# Altium schematic sheet STM32.SchDoc
size 533 x 330 mm; SheetNumber: 1; SheetTotal: 1
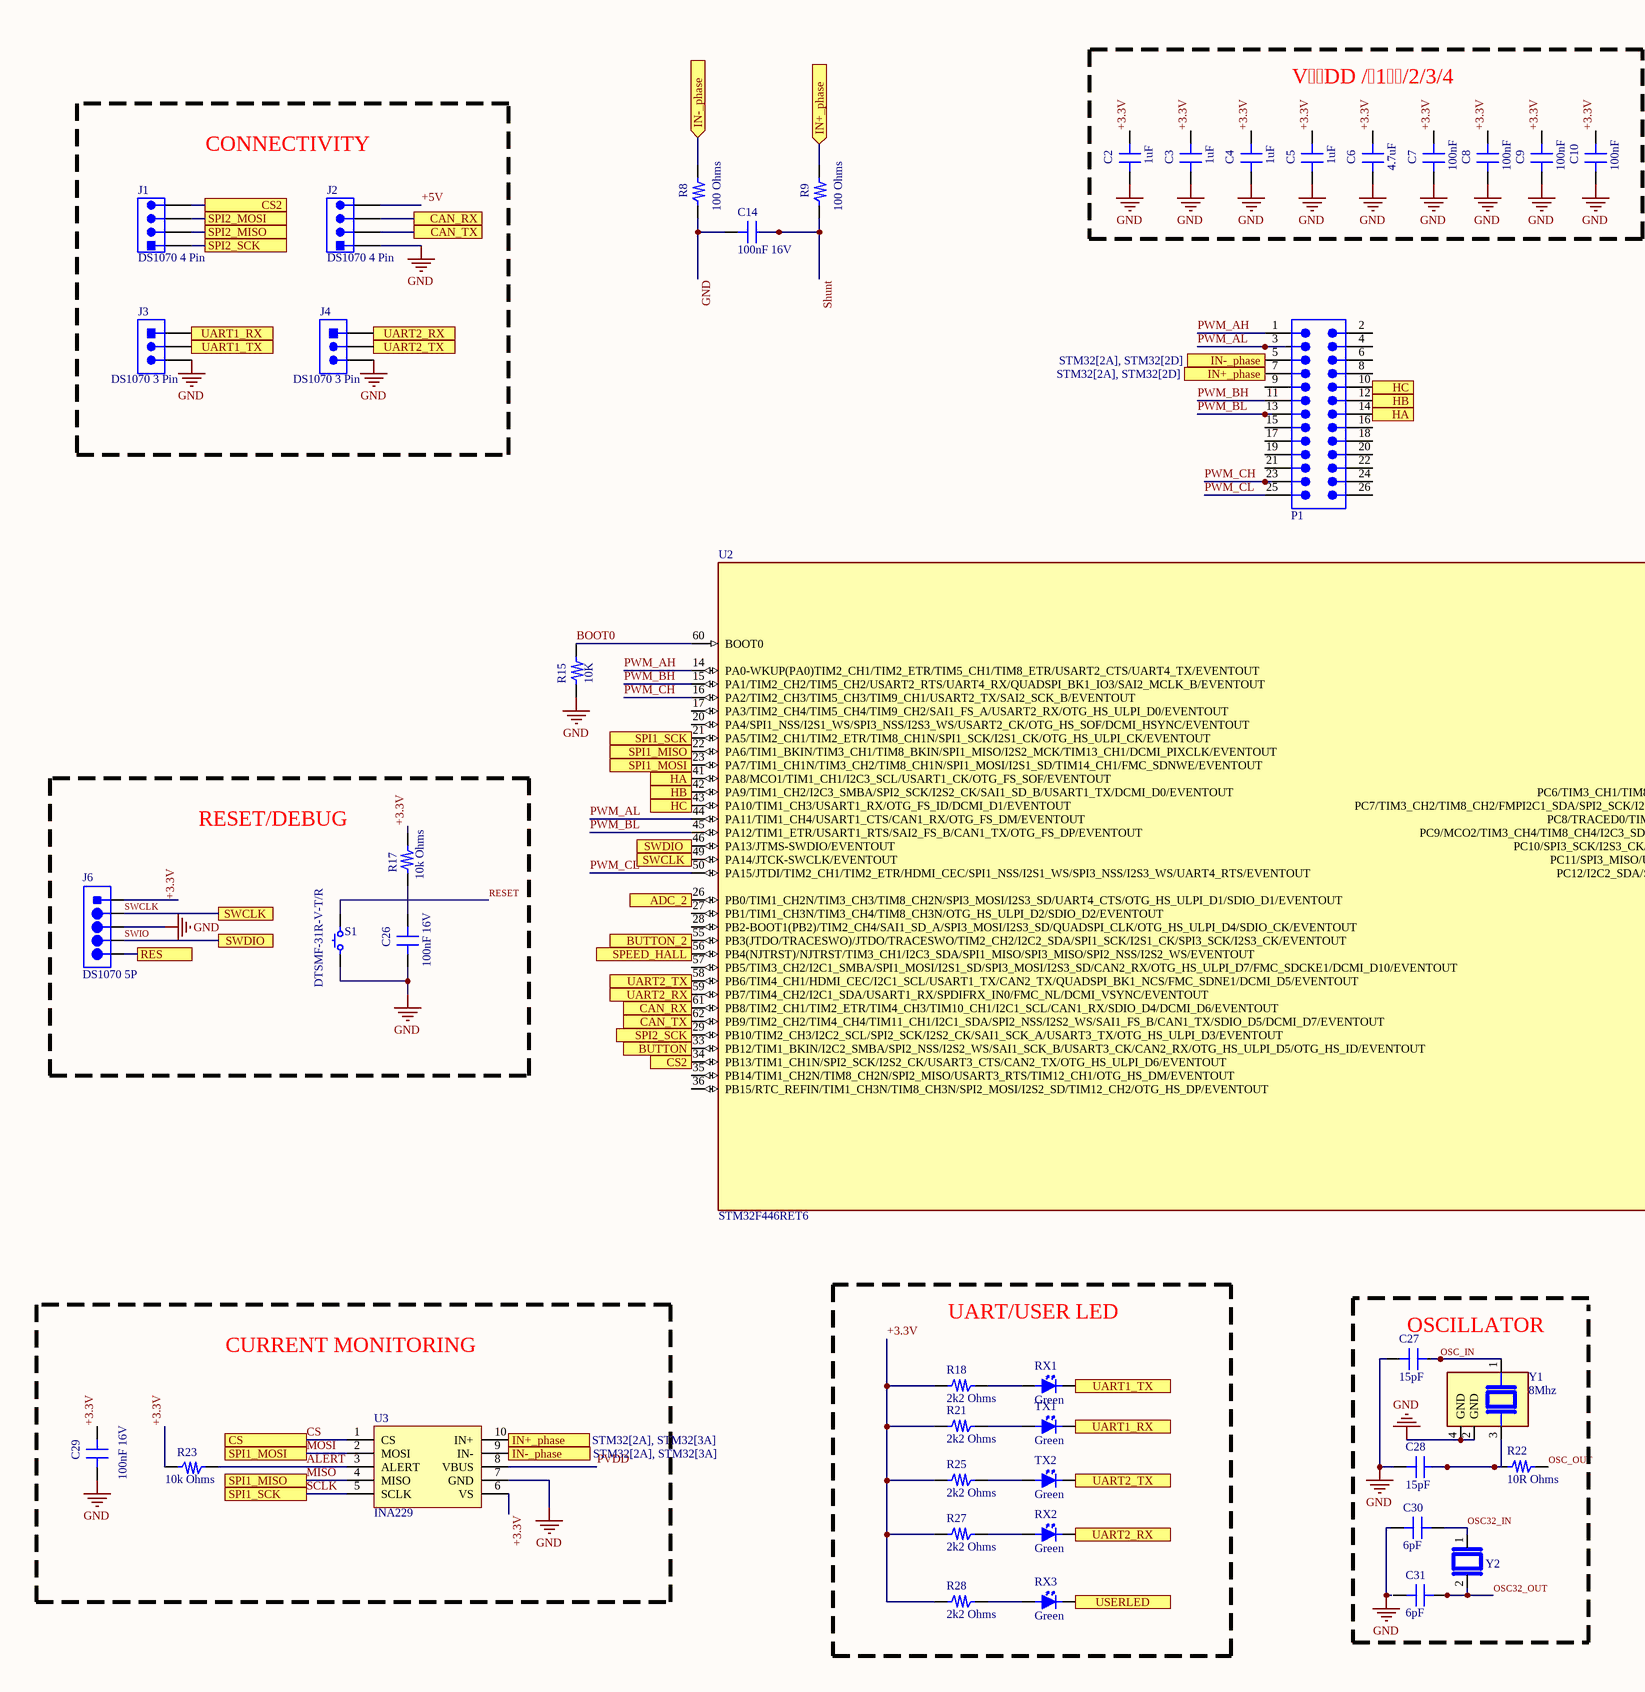
[diagram p0: STM32.SchDoc, left]
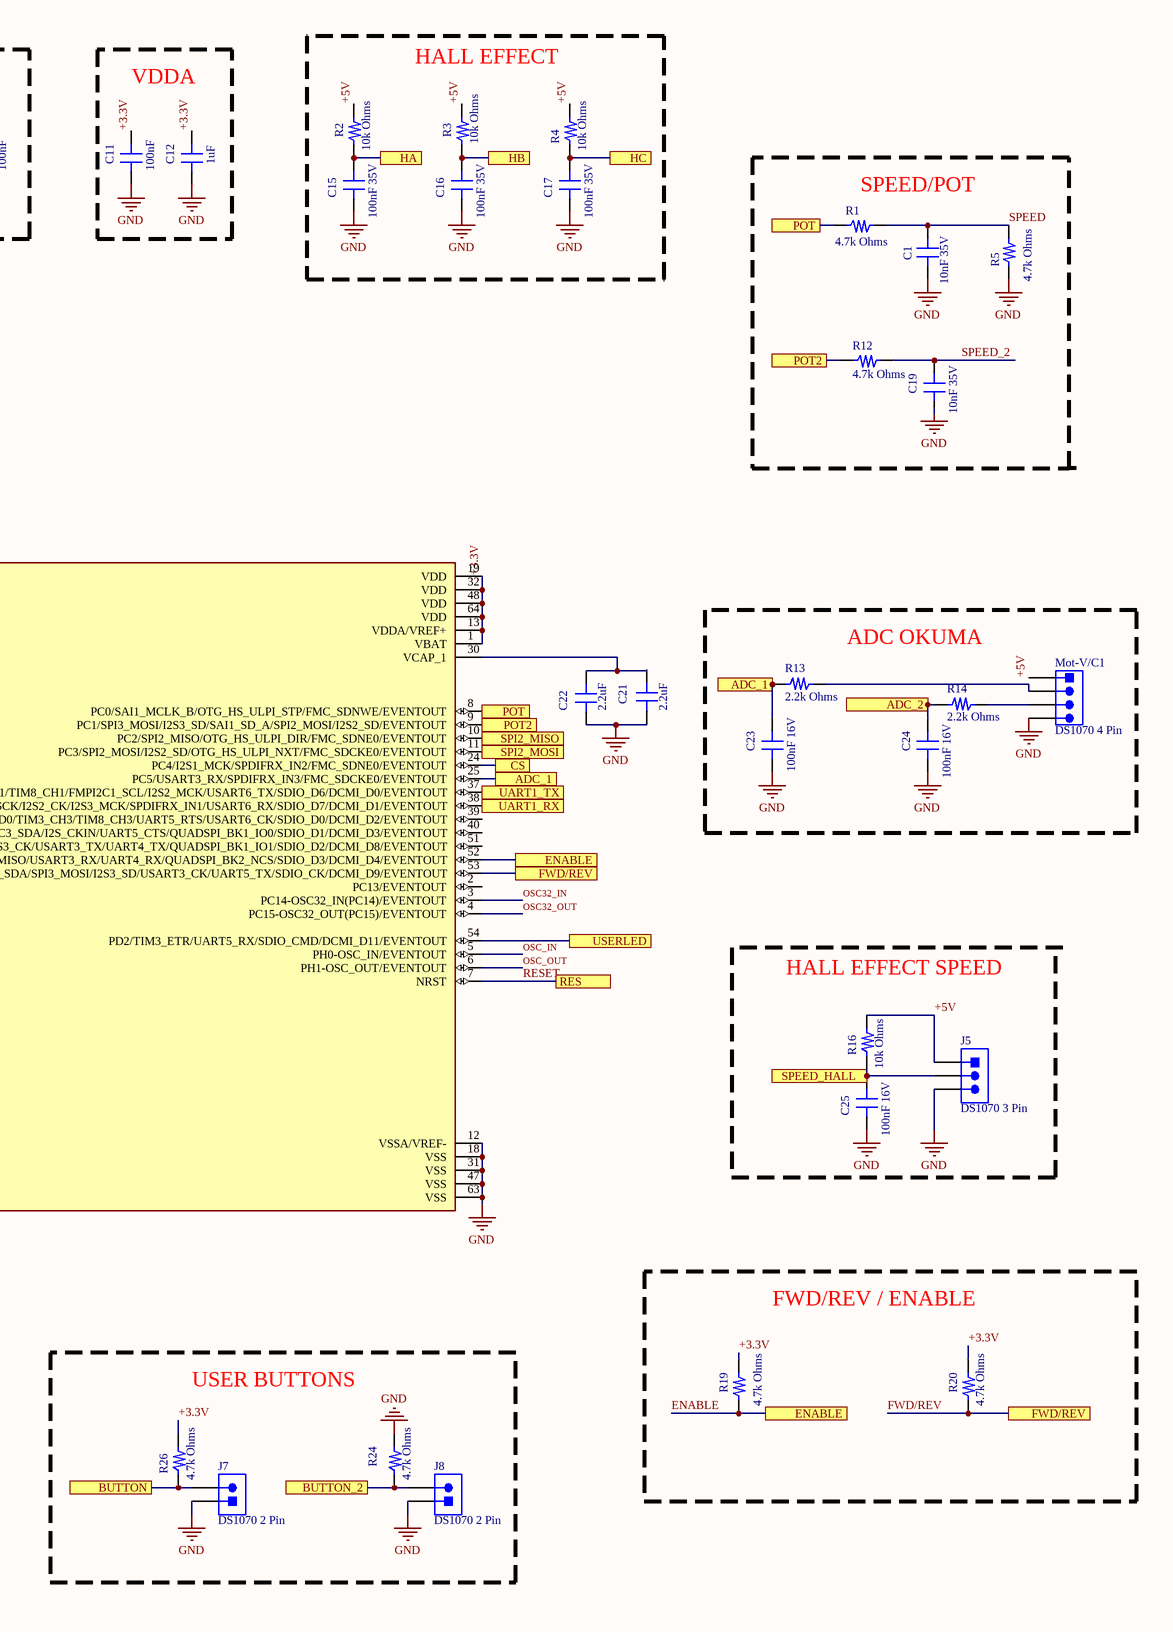
[diagram p1: STM32.SchDoc, right]

## Parts
C1  10nF 35V  [0805_CAP]
C2  1uF  [0603_CAP]
C3  1uF  [0603_CAP]
C4  1uF  [0603_CAP]
C5  1uF  [0603_CAP]
C6  4.7uF  [0603_CAP]
C7  100nF  [0603_CAP]
C8  100nF  [0603_CAP]
C9  100nF  [0603_CAP]
C10  100nF  [0603_CAP]
C11  100nF  [0603_CAP]
C12  1uF  [0603_CAP]
C14  100nF 16V  [0603_CAP]
C15  100nF 35V  [0805_CAP]
C16  100nF 35V  [0805_CAP]
C17  100nF 35V  [0805_CAP]
C19  10nF 35V  [0805_CAP]
C21  2.2uF  [0603_CAP]
C22  2.2uF  [0603_CAP]
C23  100nF 16V  [0805_CAP]
C24  100nF 16V  [0805_CAP]
C25  100nF 16V  [0805_CAP]
C26  100nF 16V  [0805_CAP]
C27  15pF  [0603_CAP]
C28  15pF  [0603_CAP]
C29  100nF 16V  [0603_CAP]
C30  6pF  [0603_CAP]
C31  6pF  [0603_CAP]
J1  DS1070 4 Pin  [4PIN_100MIL]
J2  DS1070 4 Pin  [4PIN_100MIL]
J3  DS1070 3 Pin  [3pin_100mil]
J4  DS1070 3 Pin  [3pin_100mil]
J5  DS1070 3 Pin  [3pin_100mil]
J6  DS1070 5P  [5PIN]
J7  DS1070 2 Pin  [2PIN_100mil]
J8  DS1070 2 Pin  [2PIN_100mil]
Mot-V/C1  DS1070 4 Pin  [4PIN_100MIL]
P1  61302621121  [61302621121]  (value not drawn)
R1  4.7k Ohms  [0805_RES]
R2  10k Ohms  [0805_RES]
R3  10k Ohms  [0805_RES]
R4  10k Ohms  [0805_RES]
R5  4.7k Ohms  [0805_RES]
R8  100 Ohms  [0603_RES]
R9  100 Ohms  [0603_RES]
R12  4.7k Ohms  [0805_RES]
R13  2.2k Ohms  [0805_RES]
R14  2.2k Ohms  [0805_RES]
R15  10K  [0603_RES]
R16  10k Ohms  [0805_RES]
R17  10k Ohms  [0805_RES]
R18  2k2 Ohms  [0805_RES]
R19  4.7k Ohms  [0805_RES]
R20  4.7k Ohms  [0805_RES]
R21  2k2 Ohms  [0805_RES]
R22  10R Ohms  [0603_RES]
R23  10k Ohms  [0603_RES]
R24  4.7k Ohms  [0805_RES]
R25  2k2 Ohms  [0805_RES]
R26  4.7k Ohms  [0805_RES]
R27  2k2 Ohms  [0805_RES]
R28  2k2 Ohms  [0805_RES]
RX1  Green  [0805LED]
RX2  Green  [0805LED]
RX3  Green  [0805LED]
S1  DTSMF-31R-V-T/R  [Button]
TX1  Green  [0805LED]
TX2  Green  [0805LED]
U2  STM32F446RET6  [QFP50P1200X1200X160-64N]
U3  INA229  [INA229]
Y1  8Mhz  [XTAL_ABM8-25.000MHZ-B2-T]
Y2  CC7V-T1A-32.768KHZ-9PF-20PPM-TA-QC  [XTAL_CC7V-T1A-32.768KHZ-9PF-20PPM-TA-QC]  (value not drawn)

## Blocks framed on the sheet
HALL EFFECT: C15-C17 R2-R4
VDD /1/2/3/4: C2-C10
VDDA: C11 C12
CONNECTIVITY: J1-J4
ADC OKUMA: C23 C24 Mot-V/C1 R13 R14
RESET/DEBUG: C26 J6 R17 S1
FWD/REV / ENABLE: R19 R20
CURRENT MONITORING: C29 R23 U3
UART/USER LED: R18 R21 R25 R27 R28 RX1-RX3 TX1 TX2
USER BUTTONS: J7 J8 R24 R26

## Ports
ADC_1 (see STM32[5B]), ADC_2 (see STM32[2C]), ADC_2 (see STM32[6B]), BUTTON (see STM32[2C]), BUTTON (see STM32[4D]), BUTTON_2 (see STM32[2C]), BUTTON_2 (see STM32[5D]), CAN_RX (see STM32[1A]), CAN_TX (see STM32[1A]), CS2 (see STM32[1B]), CS2 (see STM32[2C]), CS (see STM32[1D]), CS (see STM32[5B]), ENABLE (see STM32[5C]), ENABLE (see STM32[6D]), FWD/REV (see STM32[5C]), FWD/REV (see STM32[6D]), HA (see STM32[2B], STM32[3A]), HA (see STM32[2B], STM32[5A]), HA (see STM32[3A], STM32[5A]), HB (see STM32[2B], STM32[3A]), HB (see STM32[2B], STM32[5A]), HB (see STM32[3A], STM32[5A]), HC (see STM32[2B], STM32[3A]), HC (see STM32[2B], STM32[5A]), HC (see STM32[3A], STM32[5A]), IN+_phase (in, see STM32[2A], STM32[2D]), IN+_phase (in, see STM32[2A], STM32[3A]), IN+_phase (in, see STM32[2D], STM32[3A]), IN-_phase (in, see STM32[2A], STM32[2D]), IN-_phase (in, see STM32[2A], STM32[3A]), IN-_phase (in, see STM32[2D], STM32[3A]), POT2 (see STM32[5B]), POT2 (see STM32[6A]), POT (see STM32[5B]), POT (see STM32[6A]), RES (see STM32[1C]), RES (see STM32[5C]), SPEED_HALL (see STM32[2C]), SPEED_HALL (see STM32[6C]), SPI1_MISO (see STM32[1D]), SPI1_MISO (see STM32[2B]), SPI1_MOSI (see STM32[1D]), SPI1_MOSI (see STM32[2B]), SPI1_SCK (see STM32[1D]), SPI1_SCK (see STM32[2B]), SPI2_MISO (see STM32[1B]), SPI2_MISO (see STM32[5B]), SPI2_MOSI (see STM32[1B]), SPI2_MOSI (see STM32[5B]), SPI2_SCK (see STM32[1B]), SPI2_SCK (see STM32[2C]), SWCLK (see STM32[1C]), SWCLK (see STM32[2C]), SWDIO (see STM32[1C]), SWDIO (see STM32[2B]), UART1_RX (see STM32[1B], STM32[3D]), UART1_RX (see STM32[1B], STM32[5B]), UART1_RX (see STM32[3D], STM32[5B]), UART1_TX (see STM32[1B], STM32[3D]), UART1_TX (see STM32[1B], STM32[5B]), UART1_TX (see STM32[3D], STM32[5B]), UART2_RX (see STM32[1B], STM32[2C]), UART2_RX (see STM32[1B], STM32[3D]), UART2_RX (see STM32[2C], STM32[3D]), UART2_TX (see STM32[1B], STM32[2C]), UART2_TX (see STM32[1B], STM32[3D]), UART2_TX (see STM32[2C], STM32[3D]), USERLED (see STM32[3D]), USERLED (see STM32[5C])

## Nets
GND: C1.1 C2.2 C3.2 C4.2 C5.2 C6.2 C7.2 C8.2 C9.2 C10.2 C11.2 C12.2 C14.2 C15.1 C16.1 C17.1 C19.1 C21.2 C22.2 C23.1 C24.1 C25.1 C26.1 C27.1 C28.1 C29.1 C30.1 J2.1 J3.3 J4.3 J5.3 J6.3 J7.1 J8.1 Mot-V/C1.4 R5.2 R8.2 R15.2 R24.1 S1.1 U2.12(VSSA/VREF-) U2.18(VSS) U2.31(VSS) U2.47(VSS) U2.63(VSS) U3.7(GND) Y1.2(GND) Y1.4(GND)
+3.3V: C2.1 C3.1 C4.1 C5.1 C6.1 C7.1 C8.1 C9.1 C10.1 C11.1 C12.1 C29.2 J6.1 R17.2 R18.1 R19.1 R20.1 R21.1 R23.2 R25.1 R26.1 R27.1 R28.1 U2.1(VBAT) U2.13(VDDA/VREF+) U2.19(VDD) U2.32(VDD) U2.48(VDD) U2.64(VDD) U3.6(VS)
+5V: J2.4 J5.1 Mot-V/C1.1 R2.1 R3.1 R4.1 R16.1
ADC_1: C23.2 R13.1 U2.25(PC5/USART3_RX/SPDIFRX_IN3/FMC_SDCKE0/EVENTOUT) ; port ADC_1
ADC_2: C24.2 R14.1 U2.26(PB0/TIM1_CH2N/TIM3_CH3/TIM8_CH2N/SPI3_MOSI/I2S3_SD/UART4_CTS/OTG_HS_ULPI_D1/SDIO_D1/EVENTOUT) ; port ADC_2
ALERT: R23.1 U3.3(ALERT)
BOOT0: R15.1 U2.60(BOOT0)
BUTTON: J7.2 R26.2 U2.33(PB12/TIM1_BKIN/I2C2_SMBA/SPI2_NSS/I2S2_WS/SAI1_SCK_B/USART3_CK/CAN2_RX/OTG_HS_ULPI_D5/OTG_HS_ID/EVENTOUT) ; port BUTTON
BUTTON_2: J8.2 R24.2 U2.55(PB3(JTDO/TRACESWO)/JTDO/TRACESWO/TIM2_CH2/I2C2_SDA/SPI1_SCK/I2S1_CK/SPI3_SCK/I2S3_CK/EVENTOUT) ; port BUTTON_2
CAN_RX: J2.3 U2.61(PB8/TIM2_CH1/TIM2_ETR/TIM4_CH3/TIM10_CH1/I2C1_SCL/CAN1_RX/SDIO_D4/DCMI_D6/EVENTOUT) ; port CAN_RX
CAN_TX: J2.2 U2.62(PB9/TIM2_CH2/TIM4_CH4/TIM11_CH1/I2C1_SDA/SPI2_NSS/I2S2_WS/SAI1_FS_B/CAN1_TX/SDIO_D5/DCMI_D7/EVENTOUT) ; port CAN_TX
CS: U2.24(PC4/I2S1_MCK/SPDIFRX_IN2/FMC_SDNE0/EVENTOUT) U3.1(CS) ; port CS
CS2: J1.4 U2.34(PB13/TIM1_CH1N/SPI2_SCK/I2S2_CK/USART3_CTS/CAN2_TX/OTG_HS_ULPI_D6/EVENTOUT) ; port CS2
ENABLE: R19.2 U2.52(PC11/SPI3_MISO/USART3_RX/UART4_RX/QUADSPI_BK2_NCS/SDIO_D3/DCMI_D4/EVENTOUT) ; port ENABLE
FWD/REV: R20.2 U2.53(PC12/I2C2_SDA/SPI3_MOSI/I2S3_SD/USART3_CK/UART5_TX/SDIO_CK/DCMI_D9/EVENTOUT) ; port FWD/REV
HA: C15.2 P1.14 R2.2 U2.41(PA8/MCO1/TIM1_CH1/I2C3_SCL/USART1_CK/OTG_FS_SOF/EVENTOUT) ; port HA
HB: C16.2 P1.12 R3.2 U2.42(PA9/TIM1_CH2/I2C3_SMBA/SPI2_SCK/I2S2_CK/SAI1_SD_B/USART1_TX/DCMI_D0/EVENTOUT) ; port HB
HC: C17.2 P1.10 R4.2 U2.43(PA10/TIM1_CH3/USART1_RX/OTG_FS_ID/DCMI_D1/EVENTOUT) ; port HC
IN+_phase: P1.7 R9.1 U3.10(IN+) ; port IN+_phase
IN-_phase: P1.5 R8.1 U3.9(IN-) ; port IN-_phase
MISO: U2.22(PA6/TIM1_BKIN/TIM3_CH1/TIM8_BKIN/SPI1_MISO/I2S2_MCK/TIM13_CH1/DCMI_PIXCLK/EVENTOUT) U3.4(MISO) ; port SPI1_MISO
MOSI: U2.23(PA7/TIM1_CH1N/TIM3_CH2/TIM8_CH1N/SPI1_MOSI/I2S1_SD/TIM14_CH1/FMC_SDNWE/EVENTOUT) U3.2(MOSI) ; port SPI1_MOSI
OSC32_IN: C30.2 U2.3(PC14-OSC32_IN(PC14)/EVENTOUT) Y2.1
OSC32_OUT: C31.2 U2.4(PC15-OSC32_OUT(PC15)/EVENTOUT) Y2.2
OSC_IN: C27.2 U2.5(PH0-OSC_IN/EVENTOUT) Y1.1
OSC_OUT: R22.2 U2.6(PH1-OSC_OUT/EVENTOUT)
POT: R1.2 U2.8(PC0/SAI1_MCLK_B/OTG_HS_ULPI_STP/FMC_SDNWE/EVENTOUT) ; port POT
POT2: R12.2 U2.9(PC1/SPI3_MOSI/I2S3_SD/SAI1_SD_A/SPI2_MOSI/I2S2_SD/EVENTOUT) ; port POT2
PVDD: U3.8(VBUS)
PWM_AH: P1.1 U2.14(PA0-WKUP(PA0)TIM2_CH1/TIM2_ETR/TIM5_CH1/TIM8_ETR/USART2_CTS/UART4_TX/EVENTOUT)
PWM_AL: P1.3 U2.44(PA11/TIM1_CH4/USART1_CTS/CAN1_RX/OTG_FS_DM/EVENTOUT)
PWM_BH: P1.11 U2.15(PA1/TIM2_CH2/TIM5_CH2/USART2_RTS/UART4_RX/QUADSPI_BK1_IO3/SAI2_MCLK_B/EVENTOUT)
PWM_BL: P1.13 U2.45(PA12/TIM1_ETR/USART1_RTS/SAI2_FS_B/CAN1_TX/OTG_FS_DP/EVENTOUT)
PWM_CH: P1.23 U2.16(PA2/TIM2_CH3/TIM5_CH3/TIM9_CH1/USART2_TX/SAI2_SCK_B/EVENTOUT)
PWM_CL: P1.25 U2.50(PA15/JTDI/TIM2_CH1/TIM2_ETR/HDMI_CEC/SPI1_NSS/I2S1_WS/SPI3_NSS/I2S3_WS/UART4_RTS/EVENTOUT)
RESET: J6.5 S1.2 U2.7(NRST) ; port RES
SCLK: U2.21(PA5/TIM2_CH1/TIM2_ETR/TIM8_CH1N/SPI1_SCK/I2S1_CK/OTG_HS_ULPI_CK/EVENTOUT) U3.5(SCLK) ; port SPI1_SCK
Shunt: C14.1 R9.2
SPEED: C1.2 R1.1 R5.1
SPEED_2: C19.2 R12.1
SPEED_HALL: C25.2 J5.2 R16.2 U2.56(PB4(NJTRST)/NJTRST/TIM3_CH1/I2C3_SDA/SPI1_MISO/SPI3_MISO/SPI2_NSS/I2S2_WS/EVENTOUT) ; port SPEED_HALL
SPI2_MISO: J1.2 U2.10(PC2/SPI2_MISO/OTG_HS_ULPI_DIR/FMC_SDNE0/EVENTOUT) ; port SPI2_MISO
SPI2_MOSI: J1.3 U2.11(PC3/SPI2_MOSI/I2S2_SD/OTG_HS_ULPI_NXT/FMC_SDCKE0/EVENTOUT) ; port SPI2_MOSI
SPI2_SCK: J1.1 U2.29(PB10/TIM2_CH3/I2C2_SCL/SPI2_SCK/I2S2_CK/SAI1_SCK_A/USART3_TX/OTG_HS_ULPI_D3/EVENTOUT) ; port SPI2_SCK
SWCLK: J6.2 U2.49(PA14/JTCK-SWCLK/EVENTOUT) ; port SWCLK
SWIO: J6.4 U2.46(PA13/JTMS-SWDIO/EVENTOUT) ; port SWDIO
UART1_RX: J3.1 TX1.2(Cathode(-)) U2.38(PC7/TIM3_CH2/TIM8_CH2/FMPI2C1_SDA/SPI2_SCK/I2S2_CK/I2S3_MCK/SPDIFRX_IN1/USART6_RX/SDIO_D7/DCMI_D1/EVENTOUT) ; port UART1_RX
UART1_TX: J3.2 RX1.2(Cathode(-)) U2.37(PC6/TIM3_CH1/TIM8_CH1/FMPI2C1_SCL/I2S2_MCK/USART6_TX/SDIO_D6/DCMI_D0/EVENTOUT) ; port UART1_TX
UART2_RX: J4.1 RX2.2(Cathode(-)) U2.59(PB7/TIM4_CH2/I2C1_SDA/USART1_RX/SPDIFRX_IN0/FMC_NL/DCMI_VSYNC/EVENTOUT) ; port UART2_RX
UART2_TX: J4.2 TX2.2(Cathode(-)) U2.58(PB6/TIM4_CH1/HDMI_CEC/I2C1_SCL/USART1_TX/CAN2_TX/QUADSPI_BK1_NCS/FMC_SDNE1/DCMI_D5/EVENTOUT) ; port UART2_TX
USERLED: RX3.2(Cathode(-)) U2.54(PD2/TIM3_ETR/UART5_RX/SDIO_CMD/DCMI_D11/EVENTOUT) ; port USERLED
NetC21_1: C21.1 C22.1 U2.30(VCAP_1)
NetC26_2: C26.2 R17.1
NetC28_2: C28.2 R22.1 Y1.3
NetMot-V/C1_2: Mot-V/C1.2 R13.2
NetMot-V/C1_3: Mot-V/C1.3 R14.2
NetR18_2: R18.2 RX1.1(Anode(+))
NetR21_2: R21.2 TX1.1(Anode(+))
NetR25_2: R25.2 TX2.1(Anode(+))
NetR27_2: R27.2 RX2.1(Anode(+))
NetR28_2: R28.2 RX3.1(Anode(+))

Not connected (* = marked no-connect by the designer): C31 1; P1 2 4 6 8 9 15 16 17 18 19 20 21 22 24 26; U2 2(PC13/EVENTOUT) 17(PA3/TIM2_CH4/TIM5_CH4/TIM9_CH2/SAI1_FS_A/USART2_RX/OTG_HS_ULPI_D0/EVENTOUT) 20(PA4/SPI1_NSS/I2S1_WS/SPI3_NSS/I2S3_WS/USART2_CK/OTG_HS_SOF/DCMI_HSYNC/EVENTOUT) 27(PB1/TIM1_CH3N/TIM3_CH4/TIM8_CH3N/OTG_HS_ULPI_D2/SDIO_D2/EVENTOUT) 28(PB2-BOOT1(PB2)/TIM2_CH4/SAI1_SD_A/SPI3_MOSI/I2S3_SD/QUADSPI_CLK/OTG_HS_ULPI_D4/SDIO_CK/EVENTOUT) 35(PB14/TIM1_CH2N/TIM8_CH2N/SPI2_MISO/USART3_RTS/TIM12_CH1/OTG_HS_DM/EVENTOUT) 36(PB15/RTC_REFIN/TIM1_CH3N/TIM8_CH3N/SPI2_MOSI/I2S2_SD/TIM12_CH2/OTG_HS_DP/EVENTOUT) 39(PC8/TRACED0/TIM3_CH3/TIM8_CH3/UART5_RTS/USART6_CK/SDIO_D0/DCMI_D2/EVENTOUT) 40(PC9/MCO2/TIM3_CH4/TIM8_CH4/I2C3_SDA/I2S_CKIN/UART5_CTS/QUADSPI_BK1_IO0/SDIO_D1/DCMI_D3/EVENTOUT) 51(PC10/SPI3_SCK/I2S3_CK/USART3_TX/UART4_TX/QUADSPI_BK1_IO1/SDIO_D2/DCMI_D8/EVENTOUT) 57(PB5/TIM3_CH2/I2C1_SMBA/SPI1_MOSI/I2S1_SD/SPI3_MOSI/I2S3_SD/CAN2_RX/OTG_HS_ULPI_D7/FMC_SDCKE1/DCMI_D10/EVENTOUT)

## Notes on the sheet
- (near R1) SPEED/POT
- (near R16) HALL EFFECT SPEED
- OSCILLATOR

## Library data of the parts
C1 C15-C17 C19 C23-C26 = CAP_0805
  C1 C19: Value: 10nF 35V
  C15-C17: Value: 100nF 35V
  C23-C26: Value: 100nF 16V
C2-C12 C21 C22 C27 C28 C30 C31 = CAP_0603: CL10B105KO8NNNC - MLCC (1608) 0603 1uF 16VDC ±10% X7R; Value: 1uF 16V
C14 C29 = CAP_0603: CL10B105KO8NNNC - MLCC (1608) 0603 1uF 16VDC ±10% X7R; Value: 100nF 16V
J1 J2 Mot-V/C1 = 4 Pin Socket: 2pin Socket 100mil
J3-J5 = 3 Pin Socket: 3 Pin 100mm Connector; ComponentLink1Description: Özdisan; ComponentLink1URL: https://www.ozdisan.com/konnektor-ve-baglanti-elemanlari/konnektor-cesitleri/pcb-konnektorler/DS1070-3MVV6; Part: DS1070 3 Pin
J6 = 5 pin socket
J7 J8 = 2 Pin Socket: 2pin Socket 100mil
P1 = 61302621121: WR-PHD Pin Header, THT, Vertical, pitch 2.54mm, 2 Row, 26P; Manufacturer: Wurth Elektronik; Contact Resistance: 20mOhm; Rated Current: 3A; Working Voltage: 250V; Withstanding Voltage: 500V; Manufacturer Part Number: 61302621121; Category: Board-to-Board Connectors; Match Code: WR-PHD; ComponentLink1Description: Website Link; ComponentLink1URL: https://www.we-online.com/redexpert/article/61302621121?ad; ComponentLink2Description: Datasheet Link; ComponentLink2URL: https://www.we-online.com/redexpert/spec/61302621121?ad; Mount: Through Hole; Operating Temperature Max: 105°C; Operating Temperature Min: -40°C; Packaging: Bag; Gender: Pin Header; Number of Pins: 26; Number of Rows: 2; Orientation: Vertical; Pitch: 2.54mm
R1-R5 R12-R14 R16-R21 R24-R28 = RES_0805: 0805; Power: 1/8 W
  R1 R5 R12 R19 R20 R24 R26: Value: 4.7k Ohms
  R2-R4 R16 R17: Value: 10k Ohms
  R13 R14: Value: 2.2k Ohms
  R18 R21 R25 R27 R28: Value: 2k2 Ohms
R8 R9 = RES_0603: 0603; Value: 82 Ohms; Power: 1/8W
R15 = RES_0603: 0603; Value: 0/10 Ohms; Power: 1/8W
R22 = 1k Ohms
R23 = RES_0603: 0603; Power: 1/8W; Value: 10k Ohms
RX1-RX3 TX1 TX2 = LED: 0805
S1 = DTSMF-31R-V-T/R: DTSMF-31R-V-T/R - SWITCH TACT 6.00x3.50 4.30mm 260gF SMT V/T; ComponentLink1Description: özdisan; ComponentLink1URL: https://ozdisan.com/elektromekanik-komponentler/sivicler-ve-anahtarlar/tact-sivicler/DTSMF-31R-V-TR
U2 = STM32F446RET6: MCU 32-Bit STM32 ARM Cortex M4 RISC 512KB Flash 2.5V/3.3V 64-Pin LQFP Tray; Availability: Unavailable; Package: None; MP: STM32F446RET6; Value: *; Price: None
Y1 = ABM8-25.000MHZ-B2-T: 25 MHz Â±20ppm Crystal 18pF 50 Ohms 4-SMD, No Lead; MF: Abracon; SnapEDA_Link: https://www.snapeda.com/parts/ABM8-25.000MHZ-B2-T/Abracon+LLC/view-part/?ref=snap; Value: *; Purchase-URL: https://pricing.snapeda.com/search/part/ABM8-25.000MHZ-B2-T/?ref=eda; MP: ABM8-25.000MHZ-B2-T; Availability: In Stock; Check_prices: https://www.snapeda.com/parts/ABM8-25.000MHZ-B2-T/Abracon+LLC/view-part/?ref=eda; Package: NON-STANDARD-4 Abracon; Price: None
Y2 = CC7V-T1A-32.768KHZ-9PF-20PPM-TA-QC: LOW FREQUENCY CRYSTAL; MF: Micro Crystal; SnapEDA_Link: https://www.snapeda.com/parts/CC7V-T1A-32.768kHz-9pF-20PPM-TA-QC/Micro+Crystal/view-part/?ref=snap; Package: SMD-2 Micro Crystal; Value: *; MP: CC7V-T1A-32.768kHz-9pF-20PPM-TA-QC; Check_prices: https://www.snapeda.com/parts/CC7V-T1A-32.768kHz-9pF-20PPM-TA-QC/Micro+Crystal/view-part/?ref=eda